# Altium schematic sheet 09_Power_Supply.SchDoc: Mainboard Power Supply
size A3; SheetNumber: 13; SheetTotal: 13
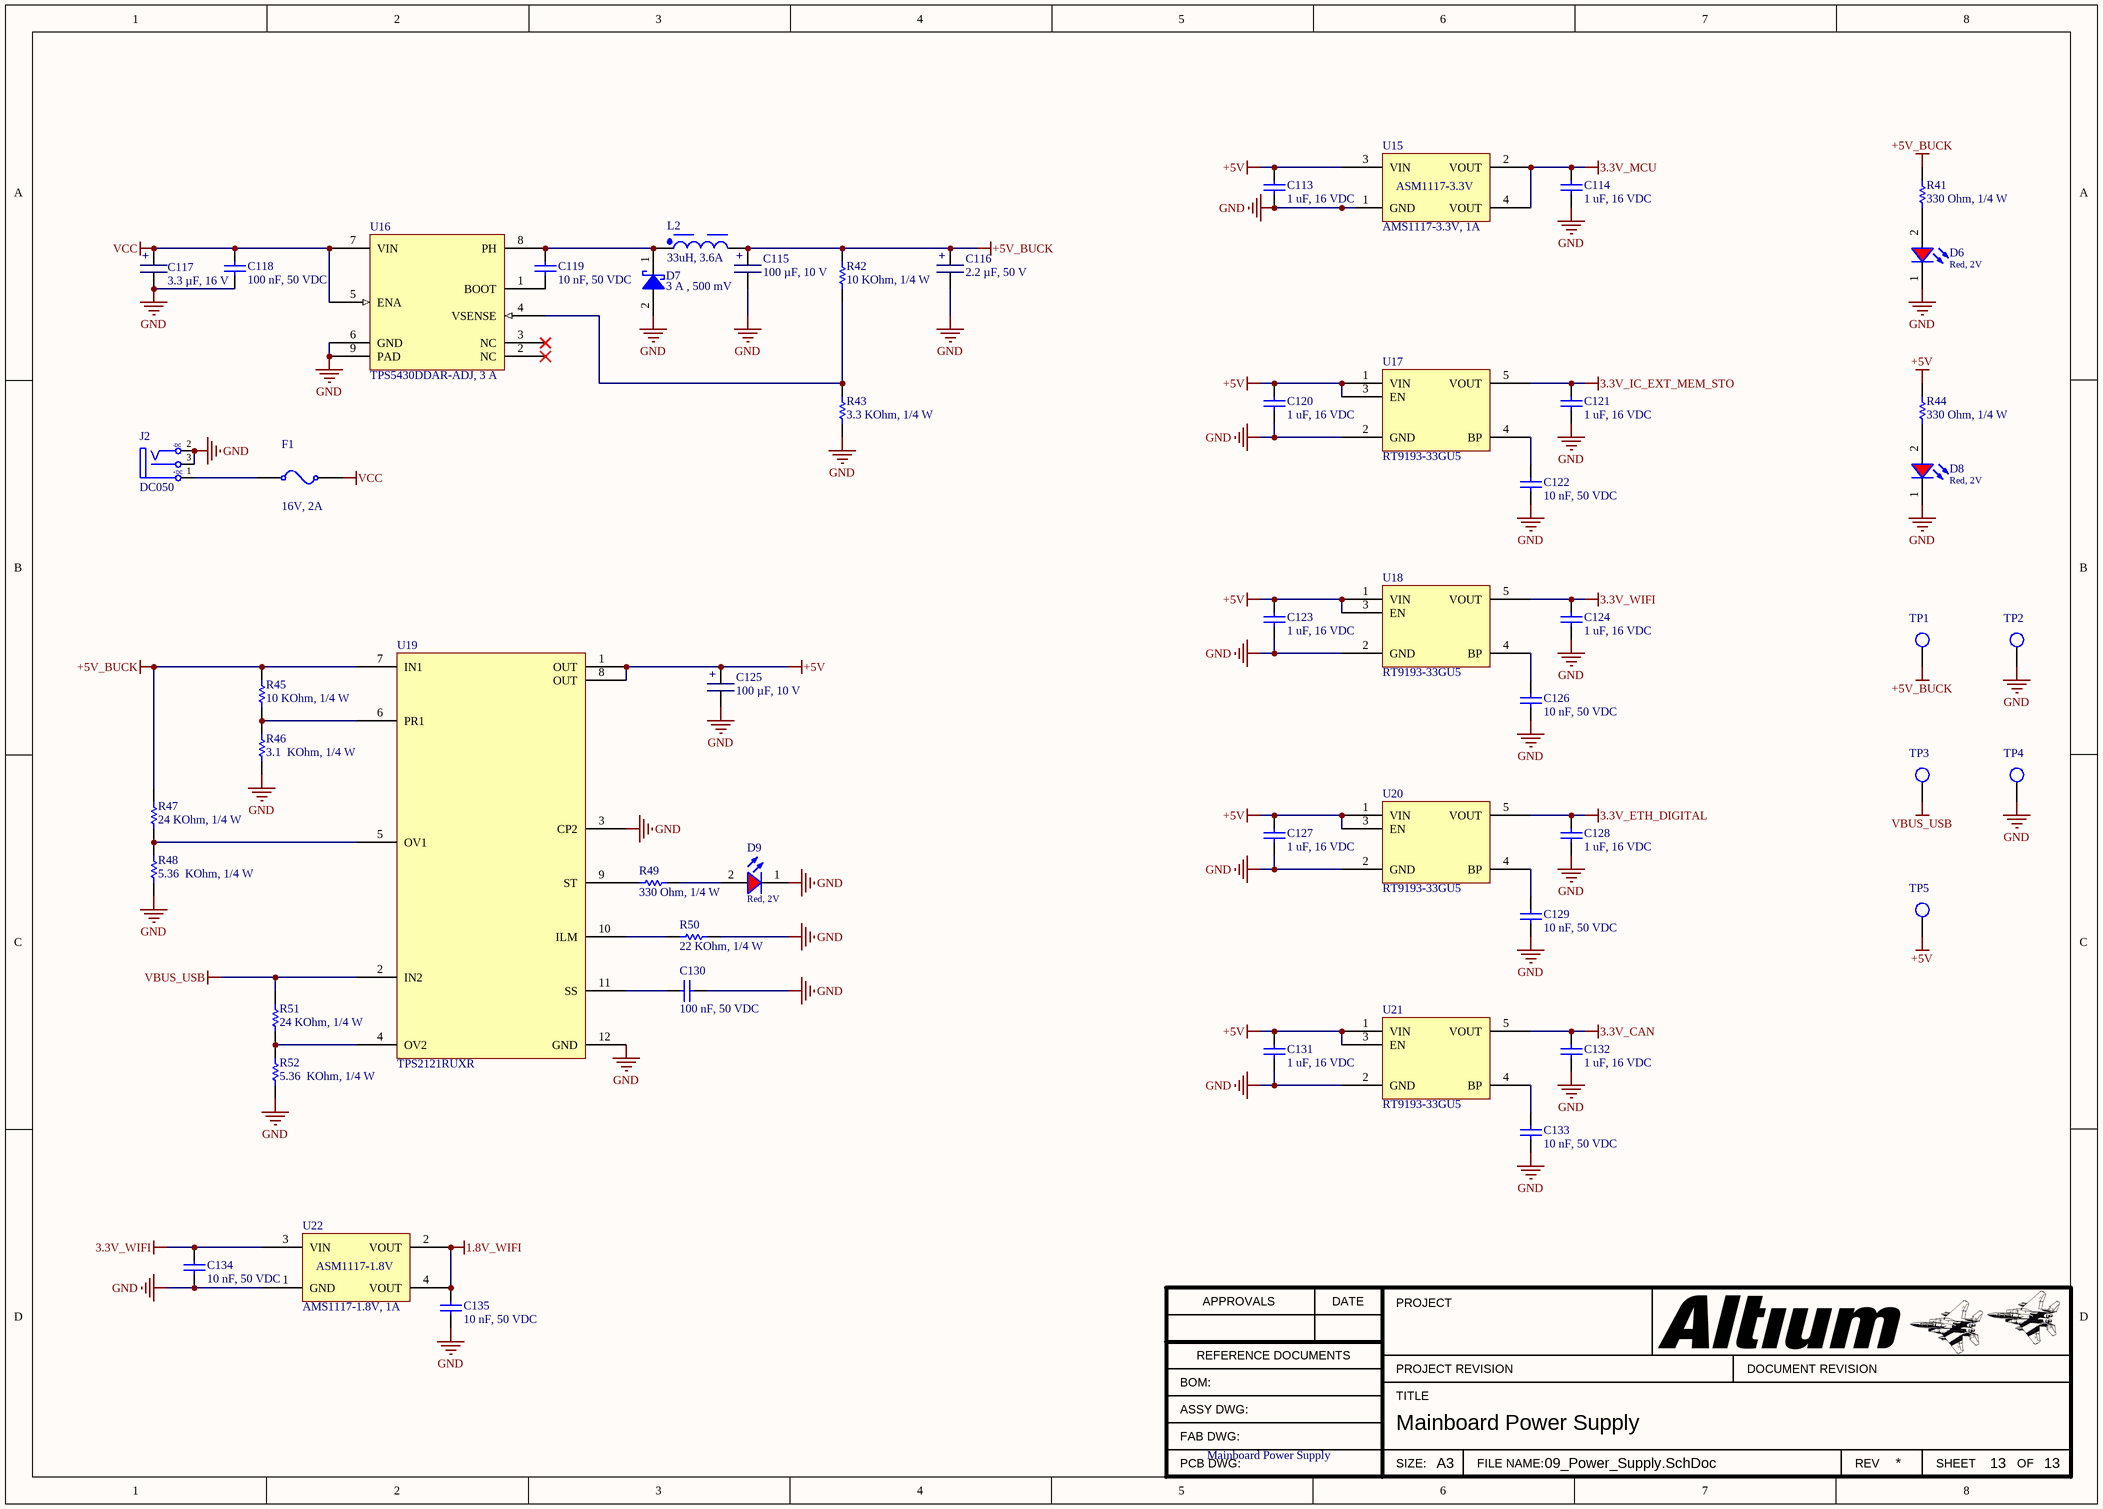
[diagram p0: 09_Power_Supply.SchDoc]

## Parts
C113  1 uF, 16 VDC  [CAP_0603]
C114  1 uF, 16 VDC  [CAP_0603]
C115  100 µF, 10 V  [TANTALUM SMD C]
C116  2.2 µF, 50 V  [TANTALUM SMD B]
C117  3.3 µF, 16 V  [TANTALUM SMD A]
C118  100 nF, 50 VDC  [CAP_0603]
C119  10 nF, 50 VDC  [CAP_0603]
C120  1 uF, 16 VDC  [CAP_0603]
C121  1 uF, 16 VDC  [CAP_0603]
C122  10 nF, 50 VDC  [CAP_0603]
C123  1 uF, 16 VDC  [CAP_0603]
C124  1 uF, 16 VDC  [CAP_0603]
C125  100 µF, 10 V  [TANTALUM SMD C]
C126  10 nF, 50 VDC  [CAP_0603]
C127  1 uF, 16 VDC  [CAP_0603]
C128  1 uF, 16 VDC  [CAP_0603]
C129  10 nF, 50 VDC  [CAP_0603]
C130  100 nF, 50 VDC  [CAP_0603]
C131  1 uF, 16 VDC  [CAP_0603]
C132  1 uF, 16 VDC  [CAP_0603]
C133  10 nF, 50 VDC  [CAP_0603]
C134  10 nF, 50 VDC  [CAP_0603]
C135  10 nF, 50 VDC  [CAP_0603]
D6  Red, 2V  [WL-SMCW_0603_H=0.7mm]
D7  3 A , 500 mV  [SMC (DO-214AB)]
D8  Red, 2V  [WL-SMCW_0603_H=0.7mm]
D9  Red, 2V  [WL-SMCW_0603_H=0.7mm]
F1  16V, 2A  [Fuse_SMD_1812]
J2  DC050  [DC050]
L2  33uH, 3.6A  [WE-PD_1280]
R41  330 Ohm, 1/4 W  [resistor_0603]
R42  10 KOhm, 1/4 W  [resistor_0603]
R43  3.3 KOhm, 1/4 W  [resistor_0603]
R44  330 Ohm, 1/4 W  [resistor_0603]
R45  10 KOhm, 1/4 W  [resistor_0603]
R46  3.1  KOhm, 1/4 W  [resistor_0603]
R47  24 KOhm, 1/4 W  [resistor_0603]
R48  5.36  KOhm, 1/4 W  [resistor_0603]
R49  330 Ohm, 1/4 W  [resistor_0603]
R50  22 KOhm, 1/4 W  [resistor_0603]
R51  24 KOhm, 1/4 W  [resistor_0603]
R52  5.36  KOhm, 1/4 W  [resistor_0603]
TP1  Test point  [TP]  (value not drawn)
TP2  Test point  [TP]  (value not drawn)
TP3  Test point  [TP]  (value not drawn)
TP4  Test point  [TP]  (value not drawn)
TP5  Test point  [TP]  (value not drawn)
U15  AMS1117-3.3V, 1A  [AMS1117-3.3V SOT223]
U16  TPS5430DDAR-ADJ, 3 A  [TPS5430DDAR]
U17  RT9193-33GU5  [RT9193-xxGU5]
U18  RT9193-33GU5  [RT9193-xxGU5]
U19  TPS2121RUXR  [TPS2121RUXR]
U20  RT9193-33GU5  [RT9193-xxGU5]
U21  RT9193-33GU5  [RT9193-xxGU5]
U22  AMS1117-1.8V, 1A  [AMS1117-1.8V SOT223]

## Nets
1.8V_WIFI: C135.2 U22.2(VOUT) U22.4(VOUT)
3.3V_CAN: C132.2 U21.5(VOUT)
3.3V_ETH_DIGITAL: C128.2 U20.5(VOUT)
3.3V_IC_EXT_MEM_STO: C121.2 U17.5(VOUT)
3.3V_MCU: C114.2 U15.2(VOUT) U15.4(VOUT)
3.3V_WIFI: C124.2 C134.2 U18.5(VOUT) U22.3(VIN)
+5V: C113.2 C120.2 C123.2 C125.2 C127.2 C131.2 R44.2 TP5.1 U15.3(VIN) U17.1(VIN) U17.3(EN) U18.1(VIN) U18.3(EN) U19.1(OUT) U19.8(OUT) U20.1(VIN) U20.3(EN) U21.1(VIN) U21.3(EN)
+5V_BUCK: C115.2 C116.2 L2.2 R41.2 R42.2 R45.2 R47.2 TP1.1 U19.7(IN1)
GND: C113.1 C114.1 C115.1 C116.1 C117.1 C118.1 C120.1 C121.1 C122.1 C123.1 C124.1 C125.1 C126.1 C127.1 C128.1 C129.1 C130.1 C131.1 C132.1 C133.1 C134.1 C135.1 D6.1(K) D7.2(A) D8.1(K) D9.1(K) J2.2(TN) J2.3(S) R43.1 R46.1 R48.1 R50.2 R52.1 TP2.1 TP4.1 U15.1(GND) U16.6(GND) U16.9(PAD) U17.2(GND) U18.2(GND) U19.3(CP2) U19.12(GND) U20.2(GND) U21.2(GND) U22.1(GND)
VBUS_USB: R51.2 TP3.1 U19.2(IN2)
VCC: C117.2 C118.2 F1.1 U16.5(ENA) U16.7(VIN)
NetC119_1: C119.1 U16.1(BOOT)
NetC119_2: C119.2 D7.1(K) L2.1 U16.8(PH)
NetC122_2: C122.2 U17.4(BP)
NetC126_2: C126.2 U18.4(BP)
NetC129_2: C129.2 U20.4(BP)
NetC130_2: C130.2 U19.11(SS)
NetC133_2: C133.2 U21.4(BP)
NetD6_2: D6.2(A) R41.1
NetD8_2: D8.2(A) R44.1
NetD9_2: D9.2(A) R49.2
NetF1_0: F1.0 J2.1(T)
NetR42_1: R42.1 R43.2 U16.4(VSENSE)
NetR45_1: R45.1 R46.2 U19.6(PR1)
NetR47_1: R47.1 R48.2 U19.5(OV1)
NetR49_1: R49.1 U19.9(ST)
NetR50_1: R50.1 U19.10(ILM)
NetR51_1: R51.1 R52.2 U19.4(OV2)

Not connected (* = marked no-connect by the designer): U16 2(NC)* 3(NC)*

## Notes on the sheet
- APPROVALS
- DATE
- PROJECT
- BOM:
- REFERENCE DOCUMENTS
- TITLE
- PROJECT REVISION
- DOCUMENT REVISION
- ASSY DWG:
- FAB DWG:
- PCB DWG:
- SIZE:
- A3
- FILE NAME:
- REV
- SHEET
- OF
- (in symbol 01120633510) +
- (in symbol 01141122510) +
- (in symbol 01231210710) +
- (in symbol AMS1117-1.8V) ASM1117-1.8V
- (in symbol AMS1117-3.3V) ASM1117-3.3V
- (in symbol DC050) -DC; +DC

## Library data of the parts
C113 C114 C120 C121 C123 C124 C127 C128 C131 C132 = 0106031051016: CAP, size 0603, 1 uF, 16 VDC; Manufacture Name: Samsung Electro-Mechanics; Manufacture SN: CL10B105KO8NNWC; Capacitance: 1 uF; Tolerance: +/-10%; Voltage Rating DC: 16 VDC; ComponentLink2Description: Datasheet; ComponentLink2URL: https://www.mouser.vn/datasheet/2/585/Samsung_MLCC_1837944-1929650.pdf; Operating Temperature: -55 to +125degC; Packaging: Tape and Reel; Mounting Technology: SMT; Size: 0603; Supplier 1 Name: Mouser; Supplier 1 SN: 187-CL10B105KO8NNWC; Supplier 1 URL: https://www.mouser.vn/ProductDetail/Samsung-Electro-Mechanics/CL10B105KO8NNWC?qs=81r%252BiQLm7BT%252BXtc72qn1ug%3D%3D&utm_source=mouser-refine-download&utm_medium=file&utm_campaign=CL10B105KO8NNWC&utm_content=Samsung-Electro-Mechanics; Supplier 2 Name: Digi-Key; Supplier 2 SN: 1276-CL10B105KO8NNWCTR-ND; Supplier 2 URL: https://www.digikey.com/en/products/detail/samsung-electro-mechanics/cl10b105ko8nnwc/16572783; Supplier 3 Name: thegioiic; Supplier 3 SN: N/A; Supplier 3 URL: https://www.thegioiic.com/tu-gom-0603-1uf-16v; Value: 1 uF, 16 VDC
C115 C125 = 01231210710: CAP TANT 100uF 10% 10V 2312; Manufacture  Name: KYOCERA AVX; Manufacture  SN: TAJC107K010RNJ; Capacitance Tolerance: +/-10%; ComponentLink1Description: Datasheet link; ComponentLink1URL: https://datasheets.kyocera-avx.com/TAJ.pdf; ComponentLink2Description: Supplier 1 URL; ComponentLink2URL: https://www.mouser.vn/ProductDetail/KYOCERA-AVX/TAJC107K010RNJ?qs=fdqkYiOtZpdKu8G0TQzFvw%3D%3D; Size: 2312; Mounting Technology: SMT; Capacitance: 100uF; ComponentLink3Description: Supplier 2 URL; ComponentLink3URL: https://www.digikey.com/en/products/detail/kyocera-avx/TAJC107K010RNJ/563809; ComponentLink4Description: Supplier 3 URL; ComponentLink4URL: https://www.thegioiic.com/tu-tantalum-100uf-10v-2312-tajc107k010rnj; Supplier 1 Name: Mouser; Supplier 1 SN: 581-TAJC107K010R; Supplier 1 URL: https://www.mouser.vn/ProductDetail/KYOCERA-AVX/TAJC107K010RNJ?qs=fdqkYiOtZpdKu8G0TQzFvw%3D%3D; Supplier 2 Name: Digi-Key; Supplier 2 SN: 478-1704-1-ND; Supplier 2 URL: https://www.digikey.com/en/products/detail/kyocera-avx/TAJC107K010RNJ/563809; Supplier 3 Name: thegioiic; Supplier 3 SN: N/A; Supplier 3 URL: https://www.thegioiic.com/tu-tantalum-100uf-10v-2312-tajc107k010rnj; Value: 100 µF, 10 V; Rated Voltage: 10 V
C116 = 01141122510: CAP TANT 2.2uF 10% 50V 1411; Manufacture  Name: KYOCERA AVX; Manufacture  SN: TAJB225K050RNJ; Capacitance Tolerance: +/-10%; ComponentLink1Description: Datasheet link; ComponentLink1URL: https://datasheets.kyocera-avx.com/TAJ.pdf; ComponentLink2Description: Supplier 1 URL; ComponentLink2URL: https://www.mouser.vn/ProductDetail/KYOCERA-AVX/TAJB225K050RNJ?qs=73RpG39PUGikdEZBwF7MGw%3D%3D; Size: 1411; Mounting Technology: SMT; Capacitance: 2.2uF; ComponentLink3Description: Supplier 2 URL; ComponentLink3URL: https://www.digikey.com/en/products/detail/kyocera-avx/TAJB225K050RNJ/2832813?s=N4IgjCBcoMxaBjKAzAhgGwM4FMA0IB7KAbXBgBYAGEAXXwAcAXKEAZUYCcBLAOwHMQAX3xgAbPBBJIaLHkIkQATnIAOUXDogmLdt35D8oxRKkyc%2BIpFJVFMW7QbNIbTrwHCQAJkrlj0SSgY5vJWXgB0ngAEAK0AYg5aTiAAqjxcjADyyACy2KiYAK4c2AZelADsfoiBshYKAKyUkQBqCdrOqelZuflFJR4AtBD%2BpkFyltblKrSCs0A; ComponentLink4Description: Supplier 3 URL; ComponentLink4URL: N/A; Supplier 1 Name: Mouser; Supplier 1 SN: 581-TAJB225K050RNJ; Supplier 1 URL: https://www.mouser.vn/ProductDetail/KYOCERA-AVX/TAJB225K050RNJ?qs=73RpG39PUGikdEZBwF7MGw%3D%3D; Supplier 2 Name: Digi-Key; Supplier 2 SN: 478-6929-1-ND; Supplier 2 URL: https://www.digikey.com/en/products/detail/kyocera-avx/TAJB225K050RNJ/2832813?s=N4IgjCBcoMxaBjKAzAhgGwM4FMA0IB7KAbXBgBYAGEAXXwAcAXKEAZUYCcBLAOwHMQAX3xgAbPBBJIaLHkIkQATnIAOUXDogmLdt35D8oxRKkyc%2BIpFJVFMW7QbNIbTrwHCQAJkrlj0SSgY5vJWXgB0ngAEAK0AYg5aTiAAqjxcjADyyACy2KiYAK4c2AZelADsfoiBshYKAKyUkQBqCdrOqelZuflFJR4AtBD%2BpkFyltblKrSCs0A; Supplier 3 Name: thegioiic; Supplier 3 SN: N/A; Supplier 3 URL: N/A; Value: 2.2 µF, 50 V; Rated Voltage: 50 V
C117 = 01120633510: CAP TANT 3.3uF 10% 16V 1206; Manufacture  Name: KYOCERA AVX; Manufacture  SN: TAJA335K016RNJ; Capacitance Tolerance: +/-10%; ComponentLink1Description: Datasheet link; ComponentLink1URL: https://datasheets.kyocera-avx.com/TAJ.pdf; ComponentLink2Description: Supplier 1 URL; ComponentLink2URL: https://www.mouser.vn/ProductDetail/KYOCERA-AVX/TAJA335K016RNJ?qs=QtLZGLLAmDYTBMXnGUwm2A%3D%3D; Size: 1206; Mounting Technology: SMT; Capacitance: 3.3uF; ComponentLink3Description: Supplier 2 URL; ComponentLink3URL: https://www.digikey.com/en/products/detail/kyocera-avx/TAJA335K016RNJ/678439; ComponentLink4Description: Supplier 3 URL; ComponentLink4URL: https://www.thegioiic.com/tu-tantalum-3-3uf-16v-1206-taja335k016rnj; Supplier 1 Name: Mouser; Supplier 1 SN: 581-TAJA335K016; Supplier 1 URL: https://www.mouser.vn/ProductDetail/KYOCERA-AVX/TAJA335K016RNJ?qs=QtLZGLLAmDYTBMXnGUwm2A%3D%3D; Supplier 2 Name: Digi-Key; Supplier 2 SN: 478-2354-1-ND; Supplier 2 URL: https://www.digikey.com/en/products/detail/kyocera-avx/TAJA335K016RNJ/678439; Supplier 3 Name: thegioiic; Supplier 3 SN: N/A; Supplier 3 URL: https://www.thegioiic.com/tu-tantalum-3-3uf-16v-1206-taja335k016rnj; Value: 3.3 µF, 16 V; Rated Voltage: 16 V
C118 C130 = 0106031041050: CAP, size 0603, 100 nF, 50 VDC; Manufacture Name: TDK; Manufacture SN: CGA3E3X8R1H104K080AE; Capacitance: 100 nF; Tolerance: +/-10%; Voltage Rating DC: 50 VDC; ComponentLink2Description: Datasheet; ComponentLink2URL: https://product.tdk.com/system/files/dam/doc/product/capacitor/ceramic/mlcc/catalog/mlcc_automotive_soft_en.pdf?ref_disty=mouser; Operating Temperature: -55 to +125degC; Packaging: Tape and Reel; Mounting Technology: SMT; Size: 0603; Supplier 1 Name: Mouser; Supplier 1 SN: 810-CGA3E3X8R1H104KA; Supplier 1 URL: https://www.mouser.com/ProductDetail/TDK/CGA3E3X8R1H104K080AE?qs=nQSIdc08i%252Bd8g3IRRgU2bw%3D%3D&utm_source=mouser-refine-download&utm_medium=file&utm_campaign=CGA3E3X8R1H104K080AE&utm_content=TDK; Supplier 2 Name: Digi-Key; Supplier 2 SN: 445-173697-2-ND; Supplier 2 URL: https://www.digikey.com/en/products/detail/tdk-corporation/cga3e3x8r1h104k080ae/5809262; Supplier 3 Name: thegioiic; Supplier 3 SN: N/A; Supplier 3 URL: N/A; Value: 100 nF, 50 VDC
C119 = 0106031031050: CAP, size 0603, 10 nF, 50 VDC; Manufacture Name: TDK; Manufacture SN: CGA3E2X8R1H103K080AA; Capacitance: 10 nF; Tolerance: +/-10%; Voltage Rating DC: 50 VDC; ComponentLink2Description: Datasheet; ComponentLink2URL: https://product.tdk.com/system/files/dam/doc/product/capacitor/ceramic/mlcc/catalog/mlcc_automotive_hightemp_en.pdf?ref_disty=mouser; Operating Temperature: -55 to +125degC; Packaging: Tape and Reel; Mounting Technology: SMT; Size: 0603; Supplier 1 Name: Mouser; Supplier 1 SN: 810-CGA3E2X8R1H103K; Supplier 1 URL: https://www.mouser.com/ProductDetail/TDK/CGA3E2X8R1H103K080AA?qs=NRhsANhppD89WrzFr8uamw%3D%3D&utm_source=mouser-refine-download&utm_medium=file&utm_campaign=CGA3E2X8R1H103K080AA&utm_content=TDK; Supplier 2 Name: Digi-Key; Supplier 2 SN: 445-5892-2-ND; Supplier 2 URL: https://www.digikey.com/en/products/detail/tdk-corporation/cga3e2x8r1h103k080aa/2443370; Supplier 3 Name: thegioiic; Supplier 3 SN: N/A; Supplier 3 URL: N/A; Value: 10 nF, 50 VDC
C122 C126 C129 C133-C135 = 0106031030550: CAP, size 0603, 10 nF, 50 VDC; Manufacture Name: TDK; Manufacture SN: CGA3E2C0G1H103J080AE; Capacitance: 10 nF; Tolerance: +/-5%; Voltage Rating DC: 50 VDC; ComponentLink2Description: Datasheet; ComponentLink2URL: https://product.tdk.com/system/files/dam/doc/product/capacitor/ceramic/mlcc/catalog/mlcc_automotive_soft_en.pdf?ref_disty=mouser; Operating Temperature: -55 to +125degC; Packaging: Tape and Reel; Mounting Technology: SMT; Size: 0603; Supplier 1 Name: Mouser; Supplier 1 SN: 810-CGA3E2C0G1H103J8; Supplier 1 URL: https://www.mouser.com/ProductDetail/TDK/CGA3E2C0G1H103J080AE?qs=P1JMDcb91o6ZkMITrWTUZQ%3D%3D&utm_source=mouser-refine-download&utm_medium=file&utm_campaign=CGA3E2C0G1H103J080AE&utm_content=TDK; Supplier 2 Name: Digi-Key; Supplier 2 SN: 445-CGA3E2C0G1H103J080AETR-ND; Supplier 2 URL: https://www.digikey.com/en/products/detail/tdk-corporation/cga3e2c0g1h103j080ae/11697946; Supplier 3 Name: thegioiic; Supplier 3 SN: N/A; Supplier 3 URL: N/A; Value: 10 nF, 50 VDC
D6 D8 D9 = 160603RedBlur: WL-SMCW SMT Mono-color Chip LED Blur, size 0603, Red, 2V, 140deg; Color: Red; Size: 0603; Type: Blur; ComponentLink1Description: Datasheet link; ComponentLink1URL: N/A; ComponentLink2Description: Supplier 1 URL; ComponentLink2URL: https://www.mouser.vn/ProductDetail/ROHM-Semiconductor/CSL1901VW1?qs=vvQtp7zwQdNmrXZcE27xEA%3D%3D; ComponentLink3Description: Supplier 2 URL; ComponentLink3URL: https://www.digikey.com/en/products/detail/rohm-semiconductor/SML-D12U8WT86/1641799; ComponentLink4Description: Supplier 3 URL; ComponentLink4URL: N/A; Supplier 1 Name: Mouser; Supplier 1 SN: 755-CSL1901VW1; Supplier 1 URL: https://www.mouser.vn/ProductDetail/ROHM-Semiconductor/CSL1901VW1?qs=vvQtp7zwQdNmrXZcE27xEA%3D%3D; Supplier 2 Name: Digi-Key; Supplier 2 SN: 511-1580-2-ND; Supplier 2 URL: https://www.digikey.com/en/products/detail/rohm-semiconductor/SML-D12U8WT86/1641799; Supplier 3 Name: ICDayRoi; Supplier 3 SN: N/A; Supplier 3 URL: N/A; Value: Red, 2V
D7 = SS34: Schottky Diodes & Rectifiers 3.0 Amp 40 Volt; Manufacturer: Vishay Semiconductors; Manufacturer SN: SS34-E3/57T; Forward Current: 3 A; Forward Voltage: 500 mV; Max Surge Current: 100 A; Peak Reverse Voltage: 40 V; Reverse Current: 500 uA; Type: Schottky; ComponentLink1Description: Datasheet link; ComponentLink1URL: https://www.vishay.com/doc?88751; ComponentLink2Description: Supplier 1 URL; ComponentLink2URL: https://www.mouser.vn/ProductDetail/Vishay-General-Semiconductor/SS34-E3-57T?qs=x2jpVgRnAtMC3f38kYWnRw%3D%3D; ComponentLink3Description: Supplier 2 URL; ComponentLink3URL: https://www.digikey.com/en/products/detail/vishay-general-semiconductor-diodes-division/ss34-e3-57t/1091554; ComponentLink4Description: Supplier 3 URL; ComponentLink4URL: https://www.thegioiic.com/ss34-sma-diode-schottky-3a; Supplier 1 Name: Mouser; Supplier 1 SN: 625-SS34-E3; Supplier 1 URL: https://www.mouser.vn/ProductDetail/Vishay-General-Semiconductor/SS34-E3-57T?qs=x2jpVgRnAtMC3f38kYWnRw%3D%3D; Supplier 2 Name: Digi-Key; Supplier 2 SN: SS34-E3/57TGITR-ND; Supplier 2 URL: https://www.digikey.com/en/products/detail/vishay-general-semiconductor-diodes-division/ss34-e3-57t/1091554; Supplier 3 Name: thegioiic; Supplier 3 SN: SS34; Supplier 3 URL: https://www.thegioiic.com/ss34-sma-diode-schottky-3a; Value: 3 A , 500 mV; Maximum Diode Capacitance: N/A; Operating Temperature: -55degC - 150degC; Package: SMC (DO-214AB); Power Dissipation: N/A; Recovery Time: N/A
F1 = 061812200016: Resettable Fuse, Size 1812, 16V, 2A; Manufacturer: Littelfuse; Threshold Current: 40A; Trip Current: 4A; Threshold Voltage: 16V; Hold Current: 2A; Size: 1812; Mounting Technology: SMT/SMD; ComponentLink1Description: Datasheet link; ComponentLink1URL: https://www.littelfuse.com/~/media/electronics/product_specifications/resettable_ptcs/littelfuse_ptc_minismdc300f_2_product_specification.pdf.pdf; ComponentLink2Description: Supplier 1 URL; ComponentLink2URL: https://www.mouser.vn/ProductDetail/Littelfuse/MINISMDC200F-16-2?qs=pBN%2FbMTRZdcH0yqkqvkPxw%3D%3D; ComponentLink3Description: Supplier 2 URL; ComponentLink3URL: https://www.digikey.com/en/products/detail/littelfuse-inc/MINISMDC200F-16-2/6348163?s=N4IgTCBcDaILIEkByCDKcAiBhMAGXAYgPQCMAbALQQC6AvkA; ComponentLink4Description: Supplier 3 URL; ComponentLink4URL: https://www.thegioiic.com/cau-chi-tu-phuc-hoi-1812-16v-2a; Supplier 1 Name: Mouser; Supplier 1 SN: 650-MINISMDC200F/162; Supplier 1 URL: https://www.mouser.vn/ProductDetail/Littelfuse/MINISMDC200F-16-2?qs=pBN%2FbMTRZdcH0yqkqvkPxw%3D%3D; Supplier 2 Name: Digi-Key; Supplier 2 SN: MINISMDC200F/16-2TR-ND; Supplier 2 URL: https://www.mouser.vn/ProductDetail/Littelfuse/MINISMDC200F-16-2?qs=pBN%2FbMTRZdcH0yqkqvkPxw%3D%3D; Supplier 3 Name: thegioiic; Supplier 3 SN: N/A; Supplier 3 URL: https://www.thegioiic.com/cau-chi-tu-phuc-hoi-1812-16v-2a; Value: 16V, 2A
J2 = DC050: Manufacturer: OEM; Rated Current: 2.5A; Working Voltage: 16V; ComponentLink1Description: Datasheet link; ComponentLink1URL: N/A; ComponentLink2Description: Supplier 1 URL; ComponentLink2URL: N/A; ComponentLink3Description: Supplier 2 URL; ComponentLink3URL: N/A; ComponentLink4Description: Supplier 3 URL; ComponentLink4URL: https://www.thegioiic.com/dc050-dau-noi-nguon-dc-cai-5521-dan-smd-kim-2-1mm; Manufacturer Part Number: N/A; Mount: SMD; Number of Pins: 4; Operating Temperature Max: N/A; Operating Temperature Min: N/A; Orientation: N/A; Packaging: N/A; Supplier 1 Name: Mouser; Supplier 1 SN: N/A; Supplier 1 URL: N/A; Supplier 2 Name: Digi-Key; Supplier 2 SN: N/A; Supplier 2 URL: N/A; Supplier 3 Name: thegioiic; Supplier 3 SN: DC050; Supplier 3 URL: https://www.thegioiic.com/dc050-dau-noi-nguon-dc-cai-5521-dan-smd-kim-2-1mm; Value: DC050
L2 = 744770133: WE-PD SMT Power Inductor, size 1280, 33uH, 3.6A, 53mOhm; Manufacturer: Wurth Elektronik; Case/Size Code: 1280; DC Resistance: 44mOhm; Saturation Current: 3.9A; Self Resonant Frequency: 8.5MHz; Type: Standard; Manufacturer Part Number: 744770133; Category: Power Inductors; Match Code: WE-PD; ComponentLink1Description: Datasheet Link; ComponentLink1URL: https://www.we-online.com/redexpert/spec/744770133?ad; ComponentLink2Description: Supplier 1 URL; ComponentLink2URL: https://www.mouser.com/ProductDetail/Wurth-Elektronik/744770133?qs=E%2F%2FhvbtCqpPKkGJl8TxFXw%3D%3D&utm_source=mouser-refine-download&utm_medium=file&utm_campaign=744770133&utm_content=Wurth-Elektronik; Mount: Surface Mount; Operating Temperature Max: 125°C; Operating Temperature Min: -40°C; Packaging: Tape and Reel; Length: 12mm; Width: 12mm; Height: 8mm; DC Resistance Max: 53mOhm; Inductance: 33uH; Rated Current: 3.6A; ComponentLink3Description: Supplier 2 URL; ComponentLink3URL: https://www.digikey.com/en/products/detail/w%C3%BCrth-elektronik/744770133/1638634; ComponentLink4Description: Supplier 3 URL; ComponentLink4URL: https://www.thegioiic.com/cdrh127-cuon-cam-dan-smd-1280-330-33uh-4-2a; Supplier 1 Name: Mouser; Supplier 1 SN: 710-744770133; Supplier 1 URL: https://www.mouser.com/ProductDetail/Wurth-Elektronik/744770133?qs=E%2F%2FhvbtCqpPKkGJl8TxFXw%3D%3D&utm_source=mouser-refine-download&utm_medium=file&utm_campaign=744770133&utm_content=Wurth-Elektronik; Supplier 2 Name: Digi-Key; Supplier 2 SN: 732-1229-2-ND; Supplier 2 URL: https://www.digikey.com/en/products/detail/w%C3%BCrth-elektronik/744770133/1638634; Supplier 3 Name: thegioiic; Supplier 3 SN: N/A; Supplier 3 URL: https://www.thegioiic.com/cdrh127-cuon-cam-dan-smd-1280-330-33uh-4-2a; Value: 33uH, 3.6A
R41 R44 R49 = 0006033311: RES, size 0603, 330 Ohm, 1/4 W; Manufacture  Name: OEM; Resistance: 330 Ohm; Rated Power: 1/4 W; Resistance Tolerance: +/-1%; Size: 0603; Mounting Technology: SMT; Supplier 1 Name: Mouser; Supplier 1 SN: 667-ERJ-UP3F3300V; Supplier 2 Name: Digi-Key; Supplier 2 SN: 10-ERJ-UP3F3300VTR-ND 10-ERJ-UP3F3300VCT-ND 10-ERJ-UP3F3300VDKR-ND; Supplier 1 URL: https://www.mouser.vn/ProductDetail/Panasonic/ERJ-UP3F3300V?qs=sGAEpiMZZMvdGkrng054twq3eZrCFN89MDZusw5Tf7mZnfRSpxxqIA%3D%3D; Supplier 3 Name: thegioiic; Supplier 3 SN: N/A; Supplier 3 URL: N/A; Manufacture  SN: OEM; Value: 330 Ohm, 1/4 W; ComponentLink1Description: Datasheet link; ComponentLink1URL: https://api.pim.na.industrial.panasonic.com/file_stream/main/fileversion/4484; ComponentLink2Description: Supplier 1 URL; ComponentLink2URL: N/A; ComponentLink3Description: Supplier 2 URL; ComponentLink3URL: https://www.digikey.com/en/products/detail/panasonic-electronic-components/ERJ-UP3F3300V/12093106; ComponentLink4Description: Supplier 3 URL; ComponentLink4URL: N/A; Supplier 2 URL: https://www.digikey.com/en/products/detail/panasonic-electronic-components/ERJ-UP3F3300V/12093106
R42 R45 = 0006031031: RES, size 0603, 10 KOhm, 1/4 W; Manufacture  Name: OEM; Resistance: 10 KOhm; Rated Power: 1/4 W; Resistance Tolerance: +/-1%; Size: 0603; Mounting Technology: SMT; Supplier 1 Name: Mouser; Supplier 1 SN: 755-ESR03EZPF1002; Supplier 2 Name: Digi-Key; Supplier 2 SN: RHM10KADTR-ND RHM10KADCT-ND RHM10KADDKR-ND; Supplier 1 URL: https://www.mouser.vn/ProductDetail/ROHM-Semiconductor/ESR03EZPF1002?qs=sGAEpiMZZMvdGkrng054t67Efho1F8r6CDeAsqwFse8%3D; Supplier 3 Name: thegioiic; Supplier 3 SN: N/A; Supplier 3 URL: N/A; Manufacture  SN: OEM; Value: 10 KOhm, 1/4 W; ComponentLink1Description: Datasheet link; ComponentLink1URL: https://fscdn.rohm.com/en/products/databook/datasheet/passive/resistor/chip_resistor/esr-e.pdf; ComponentLink2Description: Supplier 1 URL; ComponentLink2URL: N/A; ComponentLink3Description: Supplier 2 URL; ComponentLink3URL: https://www.digikey.com/en/products/detail/rohm-semiconductor/ESR03EZPF1002/1983429; ComponentLink4Description: Supplier 3 URL; ComponentLink4URL: N/A; Supplier 2 URL: https://www.digikey.com/en/products/detail/rohm-semiconductor/ESR03EZPF1002/1983429
R43 = 0006033325: RES, size 0603, 3.3 KOhm, 1/4 W; Manufacture  Name: Panasonic; Manufacture  SN: ERJ-UP3J332V; Rated Power: 1/4 W; Resistance Tolerance: +/-5%; Size: 0603; Mounting Technology: SMT; Resistance: 3.3 KOhm; Supplier 1 Name: Mouser; Supplier 1 SN: 667-ERJ-UP3J332V; Supplier 1 URL: https://www.mouser.vn/ProductDetail/Panasonic/ERJ-UP3J332V?qs=GedFDFLaBXFgKQrmrDNO%252Bg%3D%3D; Supplier 2 Name: Digi-Key; Supplier 2 SN: 10-ERJ-UP3J332VTR-ND - Tape & Reel (TR); Supplier 3 Name: thegioiic; Supplier 3 SN: N/A; Supplier 3 URL: N/A; Value: 3.3 KOhm, 1/4 W; ComponentLink1Description: Datasheet link; ComponentLink1URL: https://www.mouser.vn/datasheet/2/315/Panasonic_Resistors_Thick_Film_Anti_Sulf_Anti_Surg-1825099.pdf; ComponentLink2Description: Supplier 1 URL; ComponentLink2URL: N/A; ComponentLink3Description: Supplier 2 URL; ComponentLink3URL: https://www.digikey.com/en/products/detail/panasonic-electronic-components/ERJ-UP3J332V/12092604?s=N4IgTCBcDaIGxwOwFoCiAlAUsgqgBQGZMCCwA1EAXQF8g; ComponentLink4Description: Supplier 3 URL; ComponentLink4URL: N/A; Supplier 2 URL: https://www.digikey.com/en/products/detail/panasonic-electronic-components/ERJ-UP3J332V/12092604?s=N4IgTCBcDaIGxwOwFoCiAlAUsgqgBQGZMCCwA1EAXQF8g
R46 = 0006033121: RES, size 0603, 3.1  KOhm, 1/4 W; Manufacture  Name: OEM; Rated Power: 1/4 W; Resistance Tolerance: +/-1%; Size: 0603; Mounting Technology: SMT; Resistance: 3.1  KOhm; Supplier 1 Name: Mouser; Supplier 1 SN: 652-CHP0603FX3011ELF; Supplier 1 URL: https://www.mouser.vn/ProductDetail/Bourns/CHP0603-FX-3011ELF?qs=gZXFycFWdAOzN1n7XWkwdg%3D%3D; Supplier 2 Name: Digi-Key; Supplier 2 SN: MCT06030C3101FP500-ND; Supplier 3 Name: thegioiic; Supplier 3 SN: N/A; Supplier 3 URL: N/A; Manufacture  SN: OEM; Value: 3.1  KOhm, 1/4 W; ComponentLink1Description: Datasheet link; ComponentLink1URL: N/A; ComponentLink2Description: Supplier 1 URL; ComponentLink2URL: N/A; ComponentLink3Description: Supplier 2 URL; ComponentLink3URL: https://www.digikey.com/en/products/detail/vishay-beyschlag-draloric-bc-components/MCT06030C3101FP500/8124767; ComponentLink4Description: Supplier 3 URL; ComponentLink4URL: N/A; Supplier 2 URL: https://www.digikey.com/en/products/detail/vishay-beyschlag-draloric-bc-components/MCT06030C3101FP500/8124767
R47 R51 = 0006032431: RES, size 0603, 24 KOhm, 1/4 W; Manufacture  Name: OEM; Resistance: 24 KOhm; Rated Power: 1/4 W; Resistance Tolerance: +/-1%; Size: 0603; Mounting Technology: SMT; Supplier 1 Name: Mouser; Supplier 1 SN: 667-ERJ-UP3F2402V; Supplier 2 Name: Digi-Key; Supplier 2 SN: 10-ERJ-UP3F2402VTR-ND 10-ERJ-UP3F2402VCT-ND 10-ERJ-UP3F2402VDKR-ND; Supplier 1 URL: https://www.mouser.vn/ProductDetail/Panasonic/ERJ-UP3F2402V?qs=sGAEpiMZZMvdGkrng054twq3eZrCFN89Fbs5AlXLmHZ21ADlxtC0%252BQ%3D%3D; Supplier 3 Name: thegioiic; Supplier 3 SN: N/A; Supplier 3 URL: N/A; Manufacture  SN: OEM; Value: 24 KOhm, 1/4 W; ComponentLink1Description: Datasheet link; ComponentLink1URL: https://api.pim.na.industrial.panasonic.com/file_stream/main/fileversion/4484; ComponentLink2Description: Supplier 1 URL; ComponentLink2URL: N/A; ComponentLink3Description: Supplier 2 URL; ComponentLink3URL: https://www.digikey.com/en/products/detail/panasonic-electronic-components/ERJ-UP3F2402V/12139426; ComponentLink4Description: Supplier 3 URL; ComponentLink4URL: N/A; Supplier 2 URL: https://www.digikey.com/en/products/detail/panasonic-electronic-components/ERJ-UP3F2402V/12139426
R48 R52 = 00060353611: RES, size 0603, 5.36  KOhm, 1/4 W; Manufacture  Name: OEM; Rated Power: 1/4 W; Resistance Tolerance: +/-1%; Size: 0603; Mounting Technology: SMT; Resistance: 5.36  KOhm; Supplier 1 Name: Mouser; Supplier 1 SN: 667-ERJ-PA3F5361V; Supplier 1 URL: https://www.mouser.vn/ProductDetail/Panasonic/ERJ-PA3F5361V?qs=BzJM0faLVqV9HycZG6PMVQ%3D%3D; Supplier 2 Name: Digi-Key; Supplier 2 SN: ERJ-PA3F5361V-ND - Tape & Reel (TR); Supplier 3 Name: thegioiic; Supplier 3 SN: N/A; Supplier 3 URL: N/A; Manufacture  SN: OEM; Value: 5.36  KOhm, 1/4 W; ComponentLink1Description: Datasheet link; ComponentLink1URL: https://www.mouser.vn/datasheet/2/315/AOA0000C331-1141874.pdf; ComponentLink2Description: Supplier 1 URL; ComponentLink2URL: N/A; ComponentLink3Description: Supplier 2 URL; ComponentLink3URL: https://www.digikey.com/en/products/detail/panasonic-electronic-components/ERJ-PA3F5361V/5037943?s=N4IgTCBcDaIGxwOwFoCiAlAUsgCgQQGYAxAVgLgEYA1EAXQF8g; ComponentLink4Description: Supplier 3 URL; ComponentLink4URL: N/A; Supplier 2 URL: https://www.digikey.com/en/products/detail/panasonic-electronic-components/ERJ-PA3F5361V/5037943?s=N4IgTCBcDaIGxwOwFoCiAlAUsgCgQQGYAxAVgLgEYA1EAXQF8g
R50 = 0006032231: RES, size 0603, 22 KOhm, 1/4 W; Manufacture  Name: OEM; Resistance: 22 KOhm; Rated Power: 1/4 W; Resistance Tolerance: +/-1%; Size: 0603; Mounting Technology: SMT; Supplier 1 Name: Mouser; Supplier 1 SN: 667-ERJ-UP3F2202V; Supplier 2 Name: Digi-Key; Supplier 2 SN: 10-ERJ-UP3F2202VTR-ND 10-ERJ-UP3F2202VCT-ND 10-ERJ-UP3F2202VDKR-ND; Supplier 1 URL: https://www.mouser.vn/ProductDetail/Panasonic/ERJ-UP3F2202V?qs=sGAEpiMZZMvdGkrng054twq3eZrCFN893x5tBCka%252B6wRswHHN2WaIQ%3D%3D; Supplier 3 Name: thegioiic; Supplier 3 SN: N/A; Supplier 3 URL: N/A; Manufacture  SN: OEM; Value: 22 KOhm, 1/4 W; ComponentLink1Description: Datasheet link; ComponentLink1URL: https://api.pim.na.industrial.panasonic.com/file_stream/main/fileversion/4484; ComponentLink2Description: Supplier 1 URL; ComponentLink2URL: N/A; ComponentLink3Description: Supplier 2 URL; ComponentLink3URL: https://www.digikey.com/en/products/detail/panasonic-electronic-components/ERJ-UP3F2202V/12092693; ComponentLink4Description: Supplier 3 URL; ComponentLink4URL: N/A; Supplier 2 URL: https://www.digikey.com/en/products/detail/panasonic-electronic-components/ERJ-UP3F2202V/12092693
U15 = AMS1117-3.3V: AMS1117-3.3V, OUT 3.3V 1A.; Manufacturer: AMS; Pad Count: 4; Voltage Input Maximum: 15V; Manufacturer Part Number: N/A; Current Input Maximum: N/A; Current Output Maximum: 1A; Supplier 1 Name: Mouser; Supplier 2 Name: Digi-Key; Supplier 3 Name: thegioiic; Voltage Output: 3.3V; Mounting Technology: SMD; ComponentLink1Description: Datasheet link; ComponentLink1URL: http://www.advanced-monolithic.com/pdf/ds1117.pdf; ComponentLink2Description: Supplier 1 URL; ComponentLink2URL: N/A; ComponentLink3Description: Supplier 2 URL; ComponentLink3URL: N/A; ComponentLink4Description: Supplier 3 URL; ComponentLink4URL: N/A; Supplier 1 SN: N/A; Supplier 1 URL: N/A; Supplier 2 SN: N/A; Supplier 2 URL: N/A; Supplier 3 SN: N/A; Supplier 3 URL: https://www.thegioiic.com/ams1117-3-3v-ic-on-ap-3-3v-1a-sot-223; Value: AMS1117-3.3V, 1A
U16 = TPS5430DDAR: 5.5V to 36V Input, 3A, 500kHz Step-Down Converter; Manufacturer: Texas Instruments; Number of Outputs: 1; Output Voltage: 1.22V - 32V; Manufacturer SN: TPS5430DDAR; Mounting Style: SMD/SMT; Package / Case: WSON-10; Output Current: 3 A; ComponentLink1Description: Datasheet link; ComponentLink1URL: https://www.ti.com/lit/gpn/TPS5430; ComponentLink2Description: Supplier 1 URL; ComponentLink2URL: https://www.mouser.com/ProductDetail/Texas-Instruments/TPS5430DDAR?qs=zwk82MlA57ZJdOTovH1aYA%3D%3D; ComponentLink3Description: Supplier 2 URL; ComponentLink3URL: https://www.digikey.com/en/products/detail/texas-instruments/tps5430ddar/1671816; ComponentLink4Description: Supplier 3 URL; ComponentLink4URL: https://www.thegioiic.com/tps5430dda-ic-dieu-chinh-giam-ap-3a-8-soic; Supplier 1 Name: Mouser; Supplier 1 SN: 595-TPS5430DDAR; Supplier 1 URL: https://www.mouser.com/ProductDetail/Texas-Instruments/TPS5430DDAR?qs=zwk82MlA57ZJdOTovH1aYA%3D%3D; Supplier 2 Name: Digi-Key; Supplier 2 SN: 296-26988-2-ND; Supplier 2 URL: https://www.digikey.com/en/products/detail/texas-instruments/tps5430ddar/1671816; Supplier 3 Name: thegioiic; Supplier 3 SN: TPS5430DDA; Supplier 3 URL: https://www.thegioiic.com/tps5430dda-ic-dieu-chinh-giam-ap-3a-8-soic; Value: TPS5430DDAR-ADJ, 3 A; Voltage Input Maximum: 36V; Voltage Input Minimum: 5.5V; Voltage Output: 1.22V - 32V; Switching Frequency: 500 kHz
U17 U18 U20 U21 = RT9193-33GU5: LDO Voltage Regulators 300mA, Ultra-Low Noise, Ultra-Fast CMOS LDO Regulator, SC-70-5, 3.3V; Manufacturer: Richtek; Rated Current: 90 uA; PSRR: - 70 dB; Voltage Drop: 220 mV; Voltage Input Minimum: 2.5V; Value: RT9193-33GU5-3.3V, 300 mA; Voltage Input Maximum: 5.5V; ComponentLink1Description: Datasheet link; ComponentLink1URL: https://www.mouser.vn/datasheet/2/1458/DS9193_18-3104722.pdf; Product: LDO Voltage Regulators; Mounting Technology: SMD; Packaging: SC-70-5; Voltage Output: 3.3V; Current Output: 300 mA; Operating Temperature: - 40 C to  + 85 C; ComponentLink2Description: Supplier 1 URL; ComponentLink2URL: N/A; ComponentLink3Description: Supplier 2 URL; ComponentLink3URL: https://www.digikey.com/en/products/detail/richtek-usa-inc/RT9193-33GU5/2546976?s=N4IgTCBcDaIEoBUCcBGJBmAtO9BxAqgKwgC6AvkA; ComponentLink4Description: Supplier 3 URL; ComponentLink4URL: N/A; Supplier 1 Name: Mouser; Supplier 1 SN: N/A; Supplier 1 URL: N/A; Supplier 2 Name: Digi-Key; Supplier 2 SN: RT9193-33GU5-ND; Supplier 2 URL: https://www.digikey.com/en/products/detail/richtek-usa-inc/RT9193-33GU5/2546976?s=N4IgTCBcDaIEoBUCcBGJBmAtO9BxAqgKwgC6AvkA; Supplier 3 Name: thegioiic; Supplier 3 SN: N/A; Supplier 3 URL: N/A; Manufacturer Part Number: RT9193-33GU5
U19 = TPS2121RUXR: 2.7-V to 22-V, 56-mΩ, 4.5-A, power mux with seamless switchover; Manufacturer: Texas Instruments; Input Voltage: 2.7-22V; Number of channels: 1; Output Current: 4.5A; Active status: Active; FET: Internal; Ron: 56 mOhm; Value: 4.5A; ComponentLink1Description: Datasheet link; ComponentLink1URL: https://www.ti.com/lit/gpn/tps2121; ComponentLink2Description: Supplier 1 URL; ComponentLink2URL: https://www.mouser.vn/ProductDetail/Texas-Instruments/TPS2121RUXR?qs=qSfuJ%252Bfl%2Fd7dCYiVnUfngQ%3D%3D; ComponentLink3Description: Supplier 2 URL; ComponentLink3URL: https://www.digikey.com/en/products/detail/texas-instruments/tps2121ruxr/9859001; Manufacturer SN: TPS2121RUXR; Mounting Style: SMD/SMT; Output Voltage: 2.7-22V; Package / Case: VQFN-12; Current limit max: 4.5A; Device Type: Power MUX; ComponentLink4Description: Supplier 3 URL; ComponentLink4URL: N/A; Supplier 1 Name: Mouser; Supplier 1 SN: 595-TPS2121RUXR; Supplier 1 URL: N/A; Supplier 2 Name: Digi-Key; Supplier 2 SN: 296-53410-2-ND; Supplier 2 URL: N/A; Supplier 3 Name: thegioiic; Supplier 3 SN: N/A; Supplier 3 URL: N/A
U22 = AMS1117-1.8V: AMS1117-1.8V, OUT 1.8V 1A.; Manufacturer: AMS; Pad Count: 4; Voltage Input Maximum: 15V; Manufacturer Part Number: N/A; Current Input Maximum: N/A; Current Output Maximum: 1A; Supplier 1 Name: Mouser; Supplier 2 Name: Digi-Key; Supplier 3 Name: thegioiic; Voltage Output: 1.8V; Mounting Technology: SMD; ComponentLink1Description: Datasheet link; ComponentLink1URL: N/A; ComponentLink2Description: Supplier 1 URL; ComponentLink2URL: N/A; ComponentLink3Description: Supplier 2 URL; ComponentLink3URL: N/A; ComponentLink4Description: Supplier 3 URL; ComponentLink4URL: N/A; Supplier 1 SN: N/A; Supplier 1 URL: N/A; Supplier 2 SN: N/A; Supplier 2 URL: N/A; Supplier 3 SN: N/A; Supplier 3 URL: https://www.thegioiic.com/ams1117-1-8v-ic-on-ap-1-8v-1a-sot-223; Value: AMS1117-1.8V, 1A
TP1-TP5 = Test point: ComponentLink1Description: Supplier 1 Link